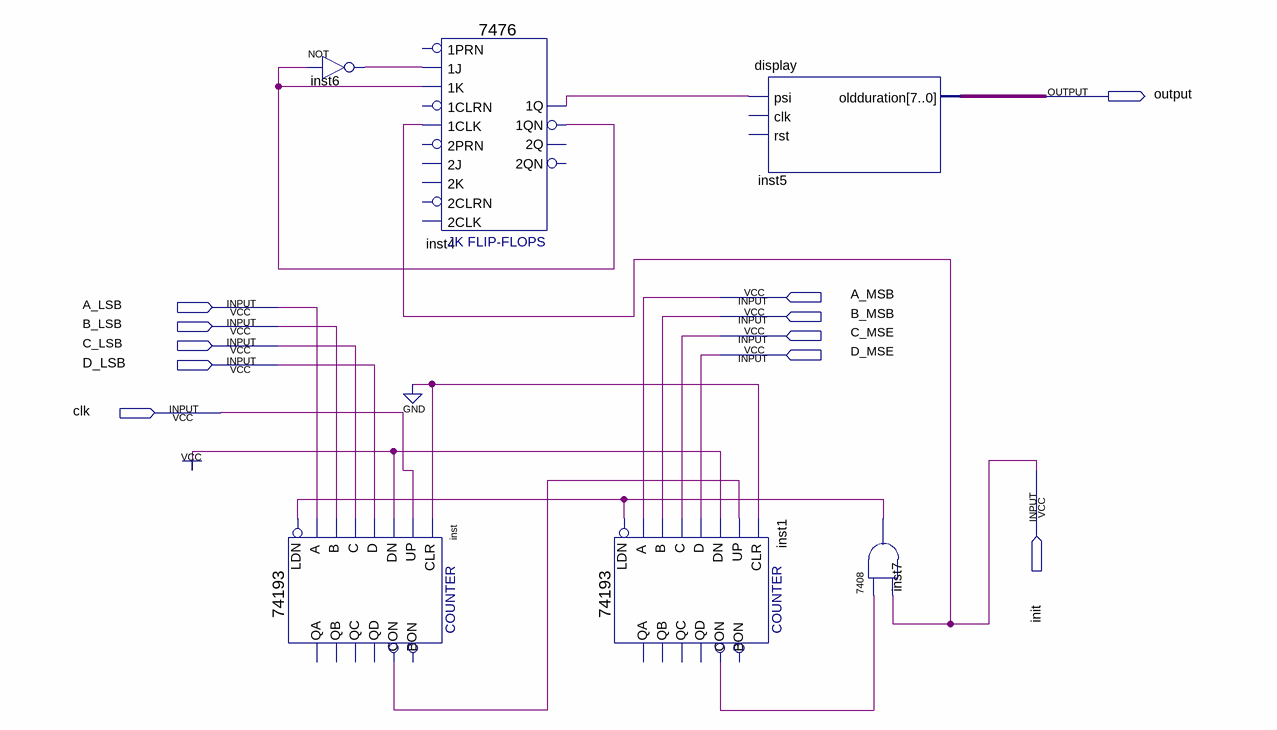
[diagram p0: schematic sheet]
// Quartus schematic lab1.bdf as structural Verilog: 6 symbols, 11 pins
module lab1 (
  input  A_MSB,
  input  A_LSB,
  input  B_MSB,
  input  B_LSB,
  input  C_MSE,
  input  C_LSB,
  input  D_MSE,
  input  D_LSB,
  input  clk,
  input  init,
  output \output 
);

  wire inst1_con, inst4_1q, inst4_1qn, inst6_out, inst7_1, inst_con;
  wire [7:0] inst5_oldduration;

  \74193  inst (
    .D(D_LSB), .C(C_LSB), .B(B_LSB), .A(A_LSB), .CLR(1'b0), .UP(clk), .DN(1'b1), .LDN(inst7_1), .CON(inst_con));  // open: QB, QA, QD, QC, BON
  not inst6 (inst6_out, inst4_1qn);
  \7476  inst4 (
    .\1J (inst6_out), .\1K (inst4_1qn), .\1CLK (init), .\1Q (inst4_1q), .\1QN (inst4_1qn));  // open: 1PRN, 2PRN, 2J, 1CLRN, 2K, 2CLRN, 2CLK, 2QN, 2Q
  \74193  inst1 (
    .D(D_MSE), .C(C_MSE), .B(B_MSB), .A(A_MSB), .CLR(1'b0), .UP(inst_con), .DN(1'b1), .LDN(inst7_1),
    .CON(inst1_con));  // open: QB, QA, QD, QC, BON
  display inst5 (.psi(inst4_1q), .oldduration(inst5_oldduration));  // open: clk, rst
  \7408  inst7 (.\3 (init), .\2 (inst1_con), .\1 (inst7_1));
endmodule
